# EAGLE design wt12_breakout_board (EAGLE 5.11)
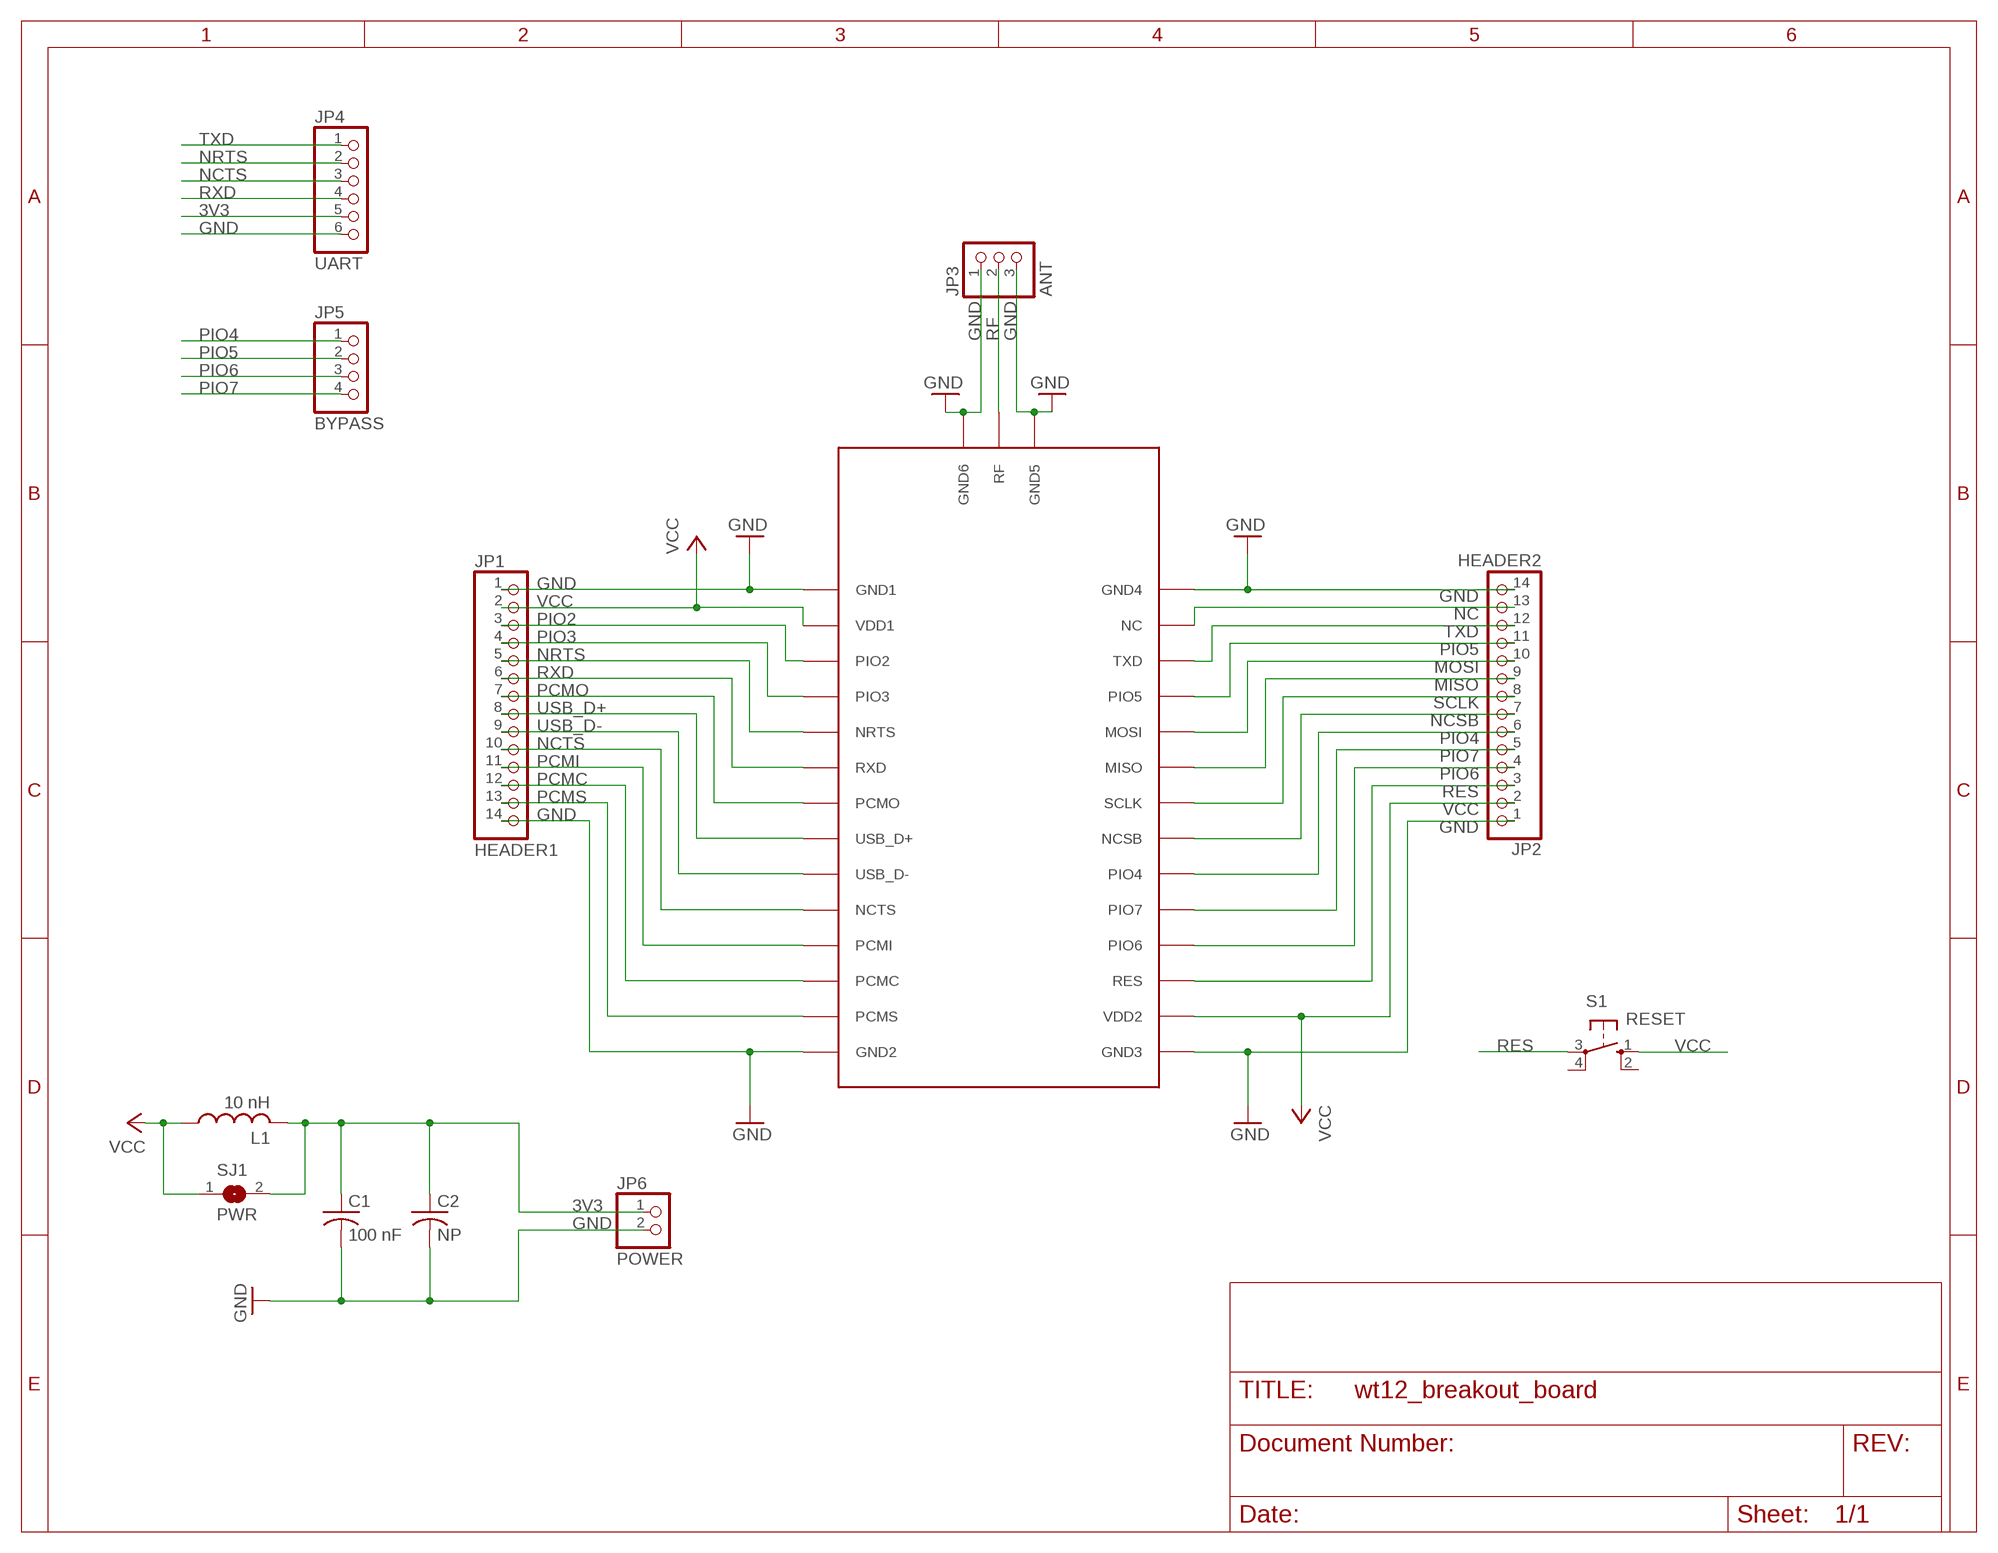
[diagram p0: schematic, sheet 1]

## Parts
C1  100 nF  C-US025-025X050  [C025-025X050]
C2  NP  C-US025-025X050  [C025-025X050]
JP1  HEADER1  PINHD-1X14  [1X14]
JP2  HEADER2  PINHD-1X14  [1X14]
JP3  ANT  PINHD-1X3  [1X03]
JP4  UART  PINHD-1X6  [1X06]
JP5  BYPASS  PINHD-1X4  [1X04]
JP6  POWER  PINHD-1X2  [1X02]
L1  10 nH  L-US0204/7  [0204/7]
S1  RESET  10-XX  [B3F-10XX]
SJ1  PWR  SJ  [SJ]
U1  WT12  [WT12]

## Nets
3V3: C1.1 C2.1 JP4.5 JP6.1 L1.2 SJ1.2
GND: C1.2 C2.2 JP1.1 JP1.14 JP2.1 JP2.14 JP3.1 JP3.3 JP4.6 JP6.2 U1.GND1 U1.GND2 U1.GND3 U1.GND4 U1.GND5 U1.GND6
MISO: JP2.9 U1.MISO
MOSI: JP2.10 U1.MOSI
NC: JP2.13 U1.NC
NCSB: JP2.7 U1.NCSB
NCTS: JP1.10 JP4.3 U1.NCTS
NRTS: JP1.5 JP4.2 U1.NRTS
PCMC: JP1.12 U1.PCMC
PCMI: JP1.11 U1.PCMI
PCMO: JP1.7 U1.PCMO
PCMS: JP1.13 U1.PCMS
PIO2: JP1.3 U1.PIO2
PIO3: JP1.4 U1.PIO3
PIO4: JP2.6 JP5.1 U1.PIO4
PIO5: JP2.11 JP5.2 U1.PIO5
PIO6: JP2.4 JP5.3 U1.PIO6
PIO7: JP2.5 JP5.4 U1.PIO7
RES: JP2.3 S1.3(P) U1.RES
RF: JP3.2 U1.RF
RXD: JP1.6 JP4.4 U1.RXD
SCLK: JP2.8 U1.SCLK
TXD: JP2.12 JP4.1 U1.TXD
USB_D+: JP1.8 U1.USB_D+
USB_D-: JP1.9 U1.USB_D-
VCC: JP1.2 JP2.2 L1.1 S1.1(S) SJ1.1 U1.VDD1 U1.VDD2
Unconnected: S1.2(S1) S1.4(P1)

## Library data of the parts
C1 C2 = resistor:C-US: CAPACITOR, American symbol
JP1 JP2 = pinhead:PINHD-1X14: PIN HEADER
JP3 = pinhead:PINHD-1X3: PIN HEADER
JP4 = pinhead:PINHD-1X6: PIN HEADER
JP5 = pinhead:PINHD-1X4: PIN HEADER
JP6 = pinhead:PINHD-1X2: PIN HEADER
L1 = resistor:L-US: INDUCTOR, American symbol
S1 = switch-omron:10-XX: OMRON SWITCH; MPN: B3F-1000; OC_FARNELL: 176432; OC_NEWARK: 36M3542
SJ1 = jumper:SJ: SMD solder JUMPER
U1 = wt12:WT12: WT12 is a class 2, Bluetooth 2.1 + EDR module. It's a highly integrated Bluetooth module, containing all the necessary elements from Bluetooth radio to antenna, and a fully implemented iWRAP protocol stack. Key Features: - Bluetooth class 2 - Integrated chip antenna - Enhanced Data Rates (EDR) with data throughput up to 2-3Mbps - Support for Adaptive Frequency Hopping (AFH) and 802.11 co-existence - USB version 2.0, UART with bypass mode, GPIO and PCM interfaces - 8MB flash memory - Size: 26 x 14 x 2,4mm - Simple iWRAP firmware for controlling Bluetooth wireless technology - Industrial temperature range from -40C to +85C - Based on CSR BC04 chipset - RoHS compliant - Up to 14 supported Bluetooth profiles in iWRAP firmware - Support for on-board applications - Fully qualified end product with Bluetooth 2.1 + EDR, CE, FCC and IC Bluegiga WT12 provides an ideal solution for developers that want to integrate Bluetooth wireless technology to their design with limited knowledge of Bluetooth and RF technologies. By using WT12 combined with Bluegiga's complete development, testing and verification service offering, and excellent developer support, OEMs and designers ensure that their products reach the market rapidly and cost-effectively in relation to time and resources. Bluegiga has in-house knowledge of both software and hardware - offering customers a single point of contact for all Bluetooth related issues.

## Net classes
0 default: width 0.254 mm, drill 0.508 mm, clearance 0.254 mm

## Board
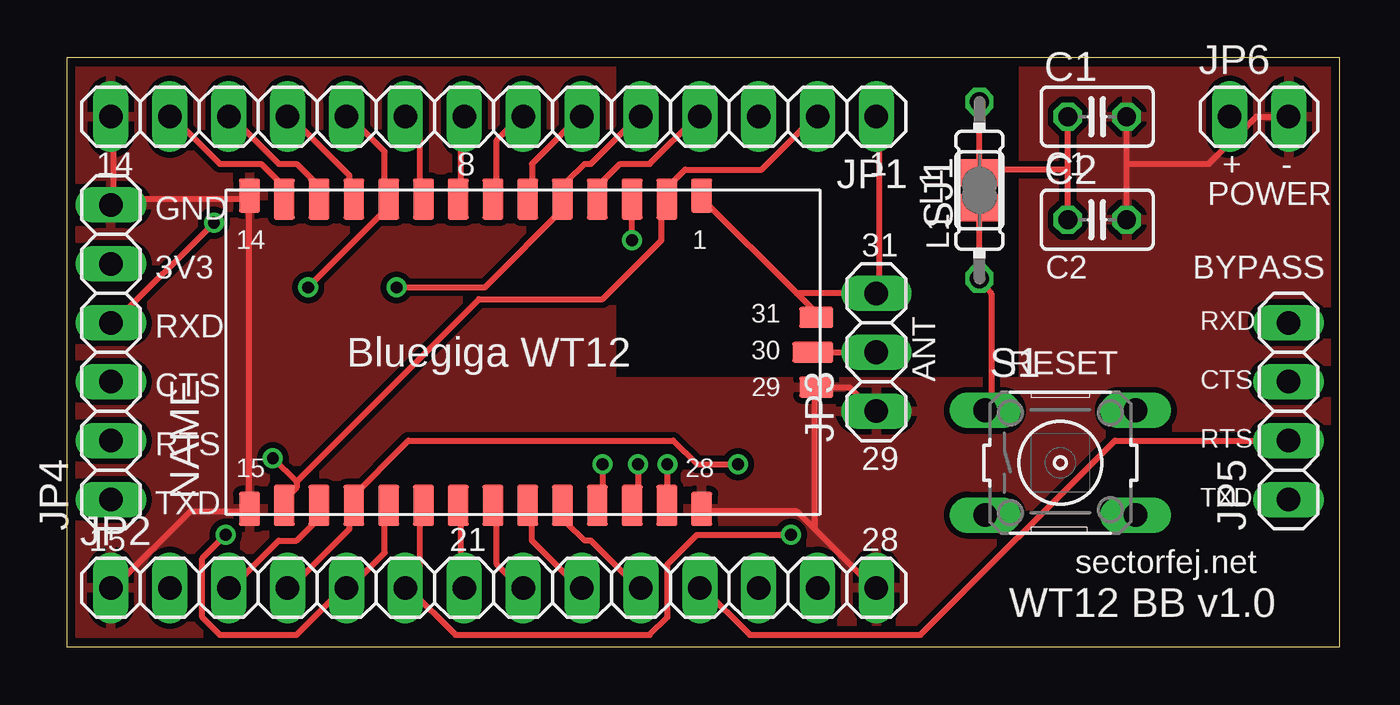
[diagram p1: board, top side]
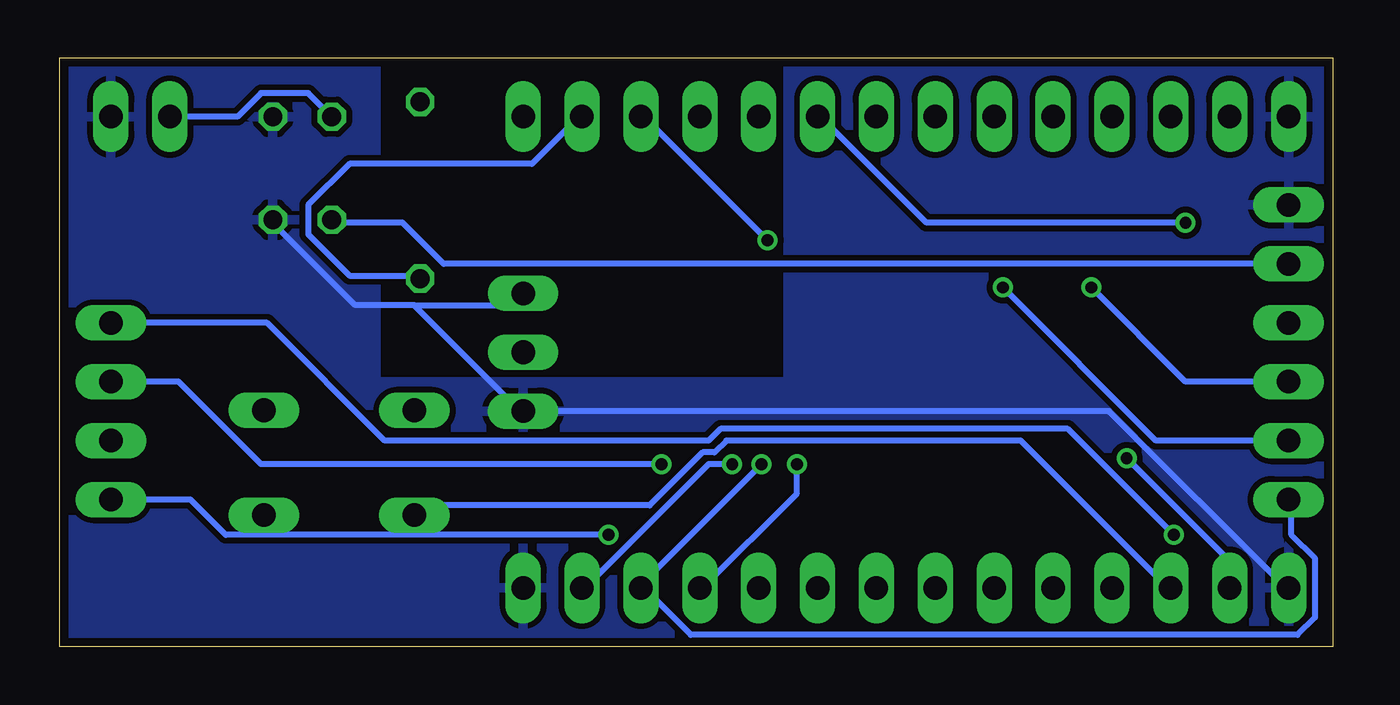
[diagram p2: board, bottom side, seen from below]

Size 54.91 x 25.39 mm. Coordinates in mm from the lower left corner, seen from the top.
Outline: 0,0 54.91,0 54.91,25.39 0,25.39 0,0
Copper layers (1*16): Top 0.0356mm / dielectric 1.5011mm / Bottom 0.0356mm
Design rules "LaenPCBOrder": minimum track width 6mil, minimum drill 13mil, track to track 6mil, track to pad 6mil, pad to pad 6mil, via to via 6mil, smd to smd 6mil, copper to edge 15mil, drill to drill 6mil, minimum pad ring 7mil, minimum via ring 7mil, stop-mask expansion 4mil, vias tented up to drill 0mil, thermal gap 10mil

### Footprints (pad centres in the part's own frame; a part is rotated, then mirrored left to right if it is on the bottom)
C025-025X050 = drill 0.813 octagon: 1 -1.27,0; 2 1.27,0
1X14 = drill 1.016 long: 1 -16.51,0; 2 -13.97,0; 3 -11.43,0; 4 -8.89,0; 5 -6.35,0; 6 -3.81,0; 7 -1.27,0; 8 1.27,0; 9 3.81,0; 10 6.35,0; 11 8.89,0; 12 11.43,0; 13 13.97,0; 14 16.51,0
1X03 = drill 1.016 long: 1 -2.54,0; 2 0,0; 3 2.54,0
1X06 = drill 1.016 long: 1 -6.35,0; 2 -3.81,0; 3 -1.27,0; 4 1.27,0; 5 3.81,0; 6 6.35,0
1X04 = drill 1.016 long: 1 -3.81,0; 2 -1.27,0; 3 1.27,0; 4 3.81,0
1X02 = drill 1.016 long: 1 -1.27,0; 2 1.27,0
0204/7 = drill 0.813 octagon: 1 -3.81,0; 2 3.81,0
B3F-10XX = drill 1.016 long: 1 -3.251,2.261; 2 3.251,2.261; 3 -3.251,-2.261; 4 3.251,-2.261
SJ = smd 1.168 x 1.6: 1 -0.762,0; 2 0.762,0
WT12 = smd 0.914 x 1.478: GND1 7.7,6.75; GND2 -11.8,6.75; GND3 -11.8,-6.75; GND4 7.7,-6.75 | smd 1.478 x 0.914: GND5 12.65,-1.5; GND6 12.65,1.5 | smd 0.914 x 1.778: MISO 0.2,-6.6; MOSI 1.7,-6.6; NC 6.2,-6.6; NCSB -2.8,-6.6; NCTS -5.8,6.6; NRTS 1.7,6.6; PCMC -8.8,6.6; PCMI -7.3,6.6; PCMO -1.3,6.6; PCMS -10.3,6.6; PIO2 4.7,6.6; PIO3 3.2,6.6; PIO4 -4.3,-6.6; PIO5 3.2,-6.6; PIO6 -7.3,-6.6; PIO7 -5.8,-6.6; RES -8.8,-6.6; RXD 0.2,6.6; SCLK -1.3,-6.6; TXD 4.7,-6.6; USB_D+ -2.8,6.6; USB_D- -4.3,6.6; VDD1 6.2,6.6; VDD2 -10.3,-6.6 | smd 1.778 x 0.914: RF 12.5,0

### Placement (x,y rotation side)
C1  44.45,22.86 0 top
C2  44.45,18.41 0 top
JP1  18.41,22.86 180 top
JP2  18.41,2.54 0 top
JP3  34.92,12.7 90 top
JP4  1.91,12.7 90 top
JP5  52.7,10.16 90 top
JP6  51.44,22.86 0 top
L1  39.37,19.68 90 top
S1  42.86,7.94 0 top
SJ1  39.37,19.68 90 top
U1  19.68,12.7 0 top

### Tracks (layer width: path | path; a pad name or v marks a point on that pad's centre or on a via)
3V3
  Top 0.254: 39.37,20.57 L1.2 | 43.18,20.57 C1.1 | C2.1 43.18,20.57 | 43.18,20.57 39.37,20.57 | 39.37,20.57 SJ1.2
  Bottom 0.254: JP4.5 38.35,16.51 40.13,18.29 43.18,18.29 C2.1 | C1.1 44.2,23.88 46.23,23.88 47.24,22.86 JP6.1
GND
  Top 0.254: JP2.1 2.03,2.54 5.33,5.84 7.87,5.84 U1.GND3 7.87,6.1 7.87,19.3 | 7.87,19.3 2.29,19.3 2.03,19.05 | 2.03,19.05 2.03,22.86 JP1.14 | 2.03,19.05 JP4.6 | 7.87,19.3 U1.GND2 | JP3.1 34.8,10.16 33.78,11.18 32.51,11.18 U1.GND5 32.26,11.18 32.26,5.08 | 32.26,5.08 34.8,2.54 JP2.14 | 32.26,5.08 31.5,5.84 27.43,5.84 U1.GND4 | 45.72,20.83 C1.2 | C2.2 45.72,20.83 | 45.72,20.83 49.28,20.83 51.31,22.86 JP6.2 | 31.5,15.24 32.51,14.22 U1.GND6 | 31.5,15.24 27.43,19.3 U1.GND1 | 31.5,15.24 JP3.3 35.05,15.24 35.05,22.86 JP1.1
  Bottom 0.254: 39.62,14.73 35.56,14.73 35.05,15.24 JP3.3 | 39.62,14.73 42.16,14.73 45.72,18.29 C2.2 | 39.62,14.73 35.05,10.16 JP3.1 9.65,10.16 2.03,2.54 JP2.1
  pour Bottom: 0,25.4 23.5,25.4 23.5,11.43 41.27,11.43 41.27,25.4 54.93,25.4 54.93,0 0,0
  pour Top: 0,25.4 23.5,25.4 23.5,11.43 41.27,11.43 41.27,25.4 54.93,25.4 54.93,0 0,0
MISO
  Top 0.254: U1.MISO 20.07,6.1 20.07,4.57 22.1,2.54 JP2.9
MOSI
  Top 0.254: U1.MOSI 21.59,6.1 21.59,5.33 22.35,4.57 22.61,4.57 24.64,2.54 JP2.10
NC  (via drill 0.51)
  Top 0.254: v25.91,7.87 25.91,6.35 U1.NC
  Bottom 0.254: v25.91,7.87 26.92,7.87 32.26,2.54 JP2.13
NCSB
  Top 0.254: U1.NCSB 17.02,6.1 17.02,2.54 JP2.7
NCTS  (via drill 0.51)
  Top 0.254: JP1.10 12.19,22.86 13.72,21.34 13.72,19.3 U1.NCTS 13.97,19.05 v10.41,15.49
  Bottom 0.254: v10.41,15.49 6.35,11.43 JP4.3
NRTS  (via drill 0.51)
  Top 0.254: JP1.5 24.64,22.86 22.61,20.83 22.35,20.83 21.59,20.07 21.59,19.3 U1.NRTS 21.59,19.05 18.03,15.49 v14.22,15.49
  Bottom 0.254: v14.22,15.49 7.62,8.89 JP4.2
PCMC
  Top 0.254: U1.PCMC 10.67,19.3 10.67,20.07 9.91,20.83 9.14,20.83 7.11,22.86 JP1.12
PCMI
  Top 0.254: U1.PCMI 12.19,19.3 12.19,20.32 9.65,22.86 JP1.11
PCMO
  Top 0.254: U1.PCMO 18.54,19.3 18.54,21.84 19.56,22.86 JP1.7
PCMS
  Top 0.254: U1.PCMS 9.14,19.3 9.14,20.07 8.38,20.83 6.6,20.83 4.57,22.86 JP1.13
PIO2  (via drill 0.51)
  Top 0.254: v24.38,17.53 24.38,19.05 U1.PIO2
  Bottom 0.254: v24.38,17.53 29.72,22.86 JP1.3
PIO3
  Top 0.254: U1.PIO3 23.11,19.3 23.11,20.07 23.88,20.83 25.15,20.83 27.18,22.86 JP1.4
PIO4  (via drill 0.51)
  Top 0.254: 14.73,2.54 15.24,3.05 15.24,6.1 U1.PIO4 | v31.24,4.83 27.18,4.83 25.91,3.56 25.91,1.27 25.15,0.51 16.76,0.51 14.73,2.54 | JP2.6 14.73,2.54
  Bottom 0.254: v31.24,4.83 47.75,4.83 49.28,6.35 JP5.1
PIO5  (via drill 0.51)
  Top 0.254: v23.11,7.87 23.11,6.35 U1.PIO5 | JP5.2 45.21,8.89 36.83,0.51 29.46,0.51 27.43,2.54 JP2.11
  Bottom 0.254: v23.11,7.87 23.11,6.6 27.18,2.54 JP2.11
PIO6  (via drill 0.51)
  Top 0.254: JP2.4 9.65,2.54 12.19,5.08 12.19,6.1 U1.PIO6 12.19,6.35 14.73,8.89 26.16,8.89 27.18,7.87 v28.96,7.87
  Bottom 0.254: v28.96,7.87 46.23,7.87 49.78,11.43 JP5.3
PIO7  (via drill 0.51)
  Top 0.254: U1.PIO7 13.72,6.1 13.72,4.06 12.19,2.54 JP2.5 11.94,2.54 9.91,0.51 6.6,0.51 5.84,1.27 5.84,3.81 v6.86,4.83
  Bottom 0.254: v6.86,4.83 11.43,9.4 26.42,9.4 26.92,8.89 40.89,8.89 45.97,13.97 JP5.4
RES
  Top 0.254: U1.RES 10.67,6.1 10.67,5.33 9.91,4.57 9.14,4.57 7.11,2.54 JP2.3
  Bottom 0.254: S1.3 39.88,6.1 29.46,6.1 27.18,8.38 26.67,8.38 26.16,8.89 13.46,8.89 7.11,2.54 JP2.3
RF
  Top 0.254: U1.RF JP3.2
RXD  (via drill 0.51)
  Top 0.254: U1.RXD 20.07,19.3 20.07,20.83 22.1,22.86 JP1.6 | v6.35,18.29 2.03,13.97 JP4.4
  Bottom 0.254: v6.35,18.29 17.53,18.29 22.1,22.86 JP1.6
SCLK
  Top 0.254: U1.SCLK 18.54,6.1 18.54,3.56 19.56,2.54 JP2.8
TXD  (via drill 0.51)
  Top 0.254: v24.64,7.87 24.64,6.35 U1.TXD
  Bottom 0.254: v24.64,7.87 29.97,2.54 JP2.12 29.72,2.54 27.69,0.51 1.52,0.51 0.76,1.27 0.76,3.81 1.78,4.83 1.78,6.35 JP4.1
USB_D+
  Top 0.254: U1.USB_D+ 17.02,19.3 17.02,22.86 JP1.8
USB_D-
  Top 0.254: U1.USB_D- 15.24,19.3 15.24,22.35 14.73,22.86 JP1.9
VCC  (via drill 0.51)
  Top 0.254: SJ1.1 L1.1 39.37,15.75 39.88,15.24 39.88,10.67 S1.1 | 9.91,7.11 9.91,6.86 9.4,6.35 U1.VDD2 | 9.91,7.11 17.78,14.99 23.11,14.99 25.65,17.53 25.65,19.05 U1.VDD1 25.91,19.3 25.91,19.81 26.67,20.57 29.97,20.57 32.26,22.86 JP1.2 | v8.89,8.13 9.91,7.11
  Bottom 0.254: v8.89,8.13 4.57,3.81 4.57,2.54 JP2.2 | L1.1 39.37,16 42.42,16 44.2,17.78 44.2,19.05 42.42,20.83 34.54,20.83 32.51,22.86 JP1.2

### Text on the board
tPlace: 14 | 8 | 1 | C1 | + | - | L1 | POWER | GND | 14 | 1 | 31 | 3V3 | C2 | BYPASS | 31 | RXD | RXD | Bluegiga WT12 | 30 | RESET | CTS | 29 | ANT | CTS | RTS | RTS | 29 | 15 | 28 | TXD | TXD | 15 | 21 | 28 | sectorfej.net | WT12 BB v1.0